# Altium schematic sheet LRA_Driver.SchDoc
size A4; SheetNumber: 1; SheetTotal: 1
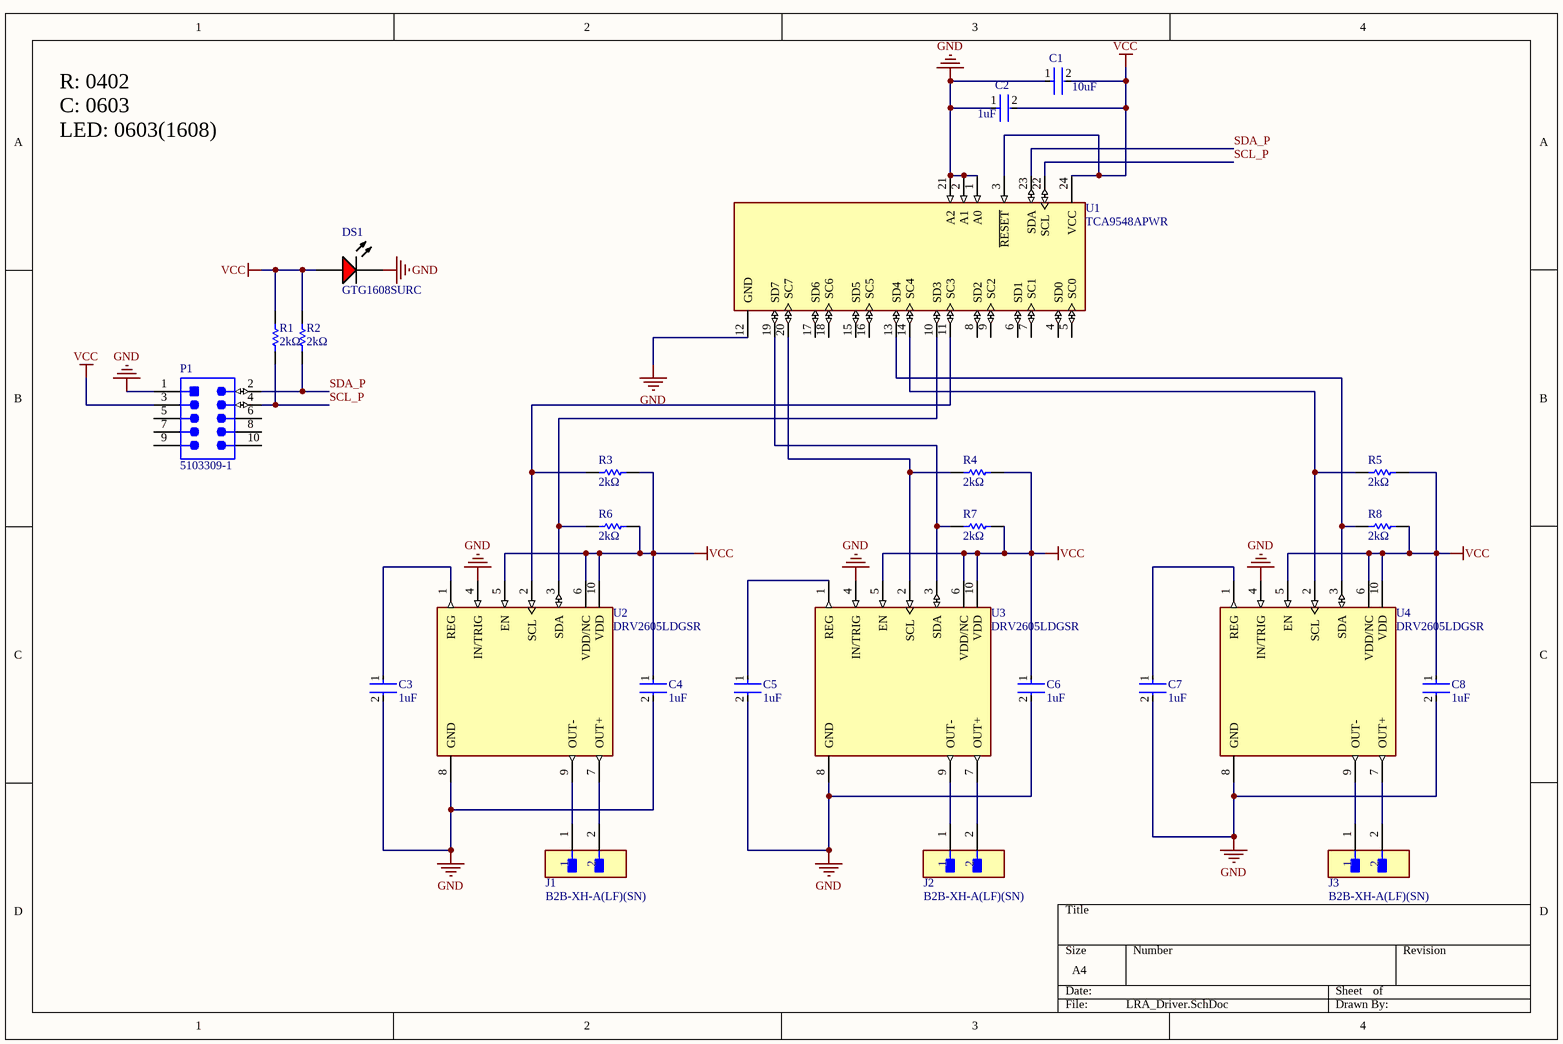
[diagram p0: LRA_Driver.SchDoc]

## Parts
C1  10uF  [FP-0603-L_1_6_0_1-W_0_8_0-IPC_A]
C2  1uF  [FP-0603-L_1_6_0_1-W_0_8_0-IPC_A]
C3  1uF  [FP-0603-L_1_6_0_1-W_0_8_0-IPC_A]
C4  1uF  [FP-0603-L_1_6_0_1-W_0_8_0-IPC_A]
C5  1uF  [FP-0603-L_1_6_0_1-W_0_8_0-IPC_A]
C6  1uF  [FP-0603-L_1_6_0_1-W_0_8_0-IPC_A]
C7  1uF  [FP-0603-L_1_6_0_1-W_0_8_0-IPC_A]
C8  1uF  [FP-0603-L_1_6_0_1-W_0_8_0-IPC_A]
DS1  GTG1608SURC  [VISH-TLMS1000_V]
J1  B2B-XH-A(LF)(SN)  [FP-B2B-XH-A_LF_SN-MFG]
J2  B2B-XH-A(LF)(SN)  [FP-B2B-XH-A_LF_SN-MFG]
J3  B2B-XH-A(LF)(SN)  [FP-B2B-XH-A_LF_SN-MFG]
P1  5103309-1  [TECO-5103309-1_V]
R1  2kΩ  [RESC1005X40X25ML10T10]
R2  2kΩ  [RESC1005X40X25ML10T10]
R3  2kΩ  [RESC1005X40X25ML10T10]
R4  2kΩ  [RESC1005X40X25ML10T10]
R5  2kΩ  [RESC1005X40X25ML10T10]
R6  2kΩ  [RESC1005X40X25ML10T10]
R7  2kΩ  [RESC1005X40X25ML10T10]
R8  2kΩ  [RESC1005X40X25ML10T10]
U1  TCA9548APWR  [FP-PW0024A-MFG]
U2  DRV2605LDGSR  [FP-DGS0010A-MFG]
U3  DRV2605LDGSR  [FP-DGS0010A-MFG]
U4  DRV2605LDGSR  [FP-DGS0010A-MFG]

## Nets
GND: C1.1 C2.1 C3.2 C4.2 C5.2 C6.2 C7.2 C8.2 DS1.2(K) P1.1 U1.1(A0) U1.2(A1) U1.12(GND) U1.21(A2) U2.4(IN/TRIG) U2.8(GND) U3.4(IN/TRIG) U3.8(GND) U4.4(IN/TRIG) U4.8(GND)
VCC: C1.2 C2.2 C4.1 C6.1 C8.1 DS1.1(A) P1.3 R1.1 R2.1 R3.1 R4.1 R5.1 R6.1 R7.1 R8.1 U1.3(~{RESET}) U1.24(VCC) U2.5(EN) U2.6(VDD/NC) U2.10(VDD) U3.5(EN) U3.6(VDD/NC) U3.10(VDD) U4.5(EN) U4.6(VDD/NC) U4.10(VDD)
SCL_P: P1.4 R1.2 U1.22(SCL)
SDA_P: P1.2 R2.2 U1.23(SDA)
NetC3_1: C3.1 U2.1(REG)
NetC5_1: C5.1 U3.1(REG)
NetC7_1: C7.1 U4.1(REG)
NetJ1_1: J1.1 U2.9(OUT-)
NetJ1_2: J1.2 U2.7(OUT+)
NetJ2_1: J2.1 U3.9(OUT-)
NetJ2_2: J2.2 U3.7(OUT+)
NetJ3_1: J3.1 U4.9(OUT-)
NetJ3_2: J3.2 U4.7(OUT+)
NetR3_2: R3.2 U1.11(SC3) U2.2(SCL)
NetR4_2: R4.2 U1.20(SC7) U3.2(SCL)
NetR5_2: R5.2 U1.14(SC4) U4.2(SCL)
NetR6_2: R6.2 U1.10(SD3) U2.3(SDA)
NetR7_2: R7.2 U1.19(SD7) U3.3(SDA)
NetR8_2: R8.2 U1.13(SD4) U4.3(SDA)

Not connected (* = marked no-connect by the designer): P1 5 6 7 8 9 10; U1 4(SD0) 5(SC0) 6(SD1) 7(SC1) 8(SD2) 9(SC2) 15(SD5) 16(SC5) 17(SD6) 18(SC6)

## Notes on the sheet
- R: 0402
  C: 0603
  LED: 0603(1608)

## Library data of the parts
C1 = CMP-14477-000544-2: 0603; Tolerance: 10%; Capacitance: 1uF; Voltage Rating: 16V; Dielectric: X5R; Packaging: Tape and Reel; Width: 0.8mm; Halogen Free: Halogen Free; Construction: Flat; Min Operating Temperature: -55°C; Package Quantity: 1; Thickness: 0.035inch; Max Operating Temperature: 85°C; Mount: Surface Mount; Case/Package: 0603; Length: 1.6mm; Series: M; Depth: 0.8mm; RoHS Compliant: Yes; Voltage Rating (DC): 16V; Radiation Hardening: No; Case Code (Imperial): 0603; Termination: SMD/SMT; Height: 0.45mm; Case Code (Metric): 1608; Resistor Type: Ceramic; Lead Free: Lead Free; Number of Pins: 2
C2-C8 = CMP-14477-000544-2: 0603; Tolerance: 10%; Voltage Rating: 16V; Dielectric: X5R; Packaging: Tape and Reel; Width: 0.8mm; Halogen Free: Halogen Free; Construction: Flat; Min Operating Temperature: -55°C; Package Quantity: 1; Thickness: 0.035inch; Max Operating Temperature: 85°C; Capacitance: 1uF; Mount: Surface Mount; Case/Package: 0603; Length: 1.6mm; Series: M; Depth: 0.8mm; RoHS Compliant: Yes; Voltage Rating (DC): 16V; Radiation Hardening: No; Case Code (Imperial): 0603; Termination: SMD/SMT; Height: 0.45mm; Case Code (Metric): 1608; Resistor Type: Ceramic; Lead Free: Lead Free; Number of Pins: 2
DS1 = CMP-2000-07254-1: Low Current LED, 40 mW, 1.8 V, -40 to 100 degC, 2-Pin SMD (0603), RoHS, Tape and Reel; Manufacturer: Vishay; Lens Shape: Rectangular; Automotive Qualification Standard: AEC-Q100; Wavelength Typ: 636nm; SVHC: ToBeAdvised; LED Colour: Red; Bulb Size: 1.6mmx0.8mm; Forward Voltage: 1.8V; Luminous Intensity: 4mcd; Forward Current If: 2mA; Viewing Angle: 80°; Datasheet Version: Rev. 1.7, 02/2011; Datasheet URL: https://datasheet.ciiva.com/5798/1698881-5798337.pdf; LED Mounting: SMD; Packaging: CutTape; Package Reference: TLMS1000; Manufacturer URL: http://www.vishay.com/; Mounting Technology: SurfaceMount; Product Range: -; Package Description: 2-Pin Surface Mount Device, Body 1.6 x 0.8 mm; MSL: MSL2-1year
J1-J3 = CMP-2000-05888-3: CONN HEADER VERT 2POS 2.5MM; Current Rating: 3A; Voltage Rating: 250V; Number of Contacts: 2; Contact Resistance: 20mR; Wire/Cable Gauge: 22AWG; Insulation Resistance: 1GR; Connector Type: Male Pin; Packaging: Bulk; Contact Material: Brass; Lead Free: Lead Free; Orientation: Straight; Contact Plating: Tin; Max Current Rating: 3A; Termination: Solder; Fastening Type: Detent; Depth: 5.75mm; Housing Material: Polyamide; REACH SVHC: No SVHC; Series: XH; Voltage Rating (AC): 250V; Number of Positions: 2; Color: Natural; Contact Type: Male Pin; Max Voltage Rating (DC): 250V; Pitch: 2.5mm; Lead Pitch: 2.5mm; Mount: Through Hole; Max Operating Temperature: 85°C; Length: 7.4mm; Max Voltage Rating (AC): 250V; Min Operating Temperature: -25°C; Number of Rows: 1; Housing Color: White
P1 = CMP-2000-07502-1: Male Header, Pitch 2.54 mm, 2 x 5 Position, Height 9.855 mm, Tail Length 3.048 mm, -65 to 105 degC, RoHS, Tube; Manufacturer: TE Connectivity; PCB Mounting Orientation: Vertical; Pitch: 2.54mm; Mating Connector Lock: No(Without); Body Material: Thermoplastic; Shrouded: Yes(With); Connector System: Wire-to-Board; Insulation Resistance: 5GR; Number of Positions: 10; Max Current Rating: 1A; PCB Mount Retention: Without; Manufacturer URL: http://www.te.com/; Contact Plating: Gold; Datasheet URL: http://www.te.com/commerce/DocumentDelivery/DDEController?Action=showdoc&DocId=Customer+Drawing%7F5103309%7FE1%7Fpdf%7FEnglish%7FENG_CD_5103309_E1.pdf%7F5103309-1; Colour: Black; Termination: ThroughHole; Housing Colour: Black; Flammability Rating: UL94V-0; Package Description: Male Header, Pitch 2.54 mm, 2 x 5 Position, Height 9.855 mm, Tail Length 3.048 mm; Mating Retention: No(Without); Orientation: Straight; Row Spacing: 2.54mm; Termination Post Length: 0.12inch; Min Operating Temperature: -65degC; Board Standoff: Yes(With); REACH SVHC: NoSVHC; Depth: 9.14mm; Lead Free: LeadFree; Gender: Male; Connector Type: Header; Shrouded End Dimension: 3.81mm; ELV: Compliant; Mating Alignment: Yes(With); Panel Mount Retention: No(Without); Package Quantity: 35; PCB Mount Alignment: No(Without); Number of Rows: 2; Package Reference: 5103309-1; Mounting Technology: ThroughHole; Mount: ThroughHole; Contact Gender: Male; Number of Contacts: 10; Length: 0.8inch; Current Rating: 1A; Contact Mating Length: 0.24inch; Max Operating Temperature: 105degC; RoHSCompliant: True; Datasheet Version: Rev. E1, 03/2011; Contact Shape: Square; Height: 8.813mm; Housing Material: PBT; Contact Material: CopperAlloy; Packaging: Rail/Tube
R1-R8 = CMP-2002-05790-1: 0402; Manufacturer: Panasonic; Part Number: ERA-2AEB202X
U1 = CMP-04892-000002-1: IC I2C SW 8CH W/RESET 24TSSOP; Manufacturer: Texas Instruments; Number Of Circuits: 1; Mux Demux Ratio: 1:8; Nominal Supply Current: 2-50uA; Interface: I2C,SMBus; Min Supply Voltage: 1.65V; Standoff Height: 0.05mm; Max Supply Voltage: 5.5V; Device Class L2: Interface ICs; ComponentLink2Description: Datasheet; Ipc Land Pattern Name: SOP65P640X120-24; Category: IC; Device Class L1: Integrated Circuits (ICs); Manufacturer Part Number: TCA9548APWR; RoHS: TRUE; Temperature Range High: +85°C; Digikey Description: IC I2C SW 8CH W/RESET 24TSSOP; Temperature Range Low: -40°C; Lead Free: Yes; Package: PW0024A; ComponentLink2URL: http://www.ti.com/lit/ds/symlink/tca9548a.pdf; Device Class L3: Multiplexers; Ambient Temperature Range Low: -40°C; Mouser Description: Low-Voltage 8-Channel I2C Switch With Reset 24-TSSOP -40 to 85; Temperature: -40°C to +85°C; Octopart: https://octopart.com/tca9548apwr-texas+instruments-22266789; Ambient Temperature Range High: +85°C; Automotive: No; Height: 1.2mm
U2-U4 = CMP-04915-000060-1: IC MOTOR DRIVER 2V-5.5V 10VSSOP; Logic Function: AND GATE; Quiescent Current: 500uA; Interface: I2C; RoHS Compliant: Yes; Min Operating Temperature: -40°C; Max Operating Temperature: 85°C; Packaging: Tape and Reel; Lead Free: Lead Free; Case/Package: VSSOP; Mount: Surface Mount